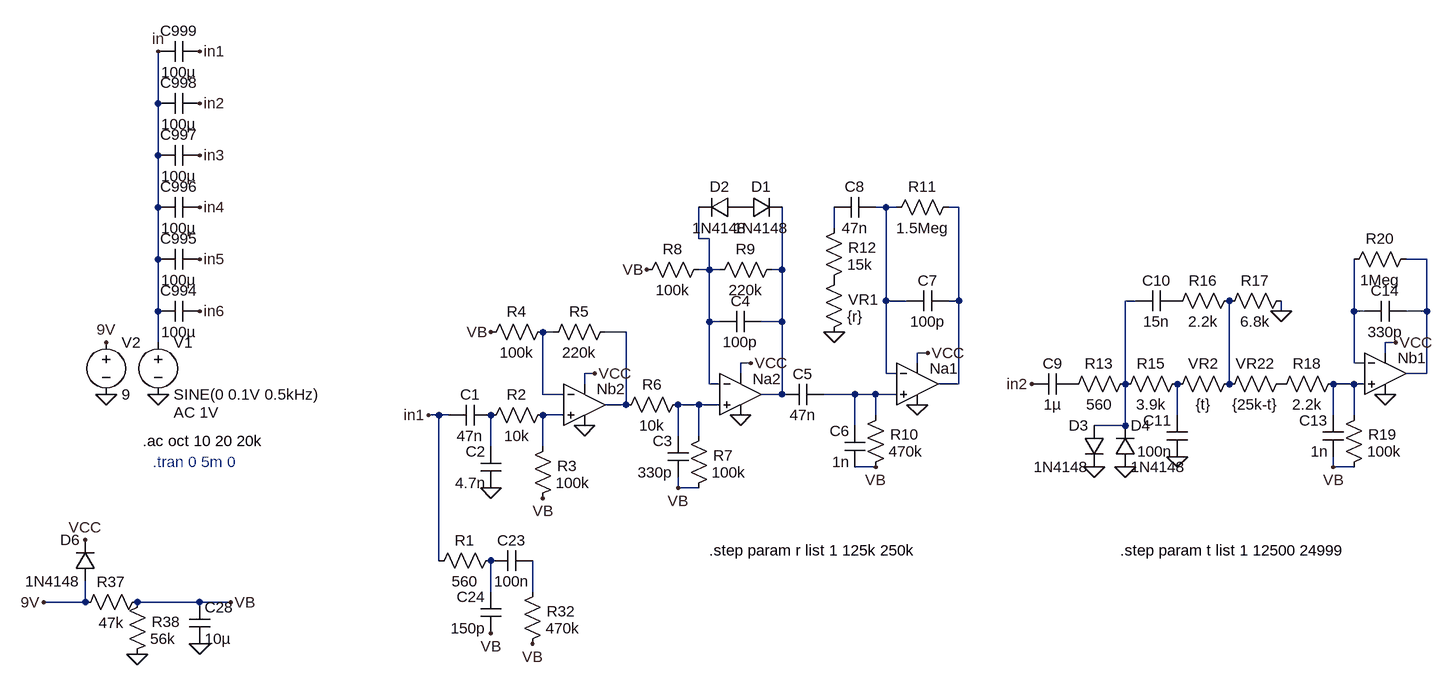
[diagram p0: schematic POS_DT-1.asc]
POS_DT-1.asc, the LTspice schematic file:
Version 4.1
SHEET 1 3408 3732
WIRE -1568 704 -1568 624
WIRE -1568 784 -1568 704
WIRE -1568 864 -1568 784
WIRE -448 864 -464 864
WIRE -432 864 -448 864
WIRE -336 864 -352 864
WIRE -528 896 -528 864
WIRE -736 912 -736 864
WIRE -720 912 -736 912
WIRE -1568 944 -1568 864
WIRE 384 944 352 944
WIRE -720 960 -720 912
WIRE -720 960 -736 960
WIRE -704 960 -720 960
WIRE -608 960 -608 864
WIRE -608 960 -624 960
WIRE -448 1008 -448 864
WIRE -416 1008 -448 1008
WIRE -336 1008 -336 864
WIRE -336 1008 -352 1008
WIRE -64 1008 -80 1008
WIRE -1568 1024 -1568 944
WIRE 160 1024 160 1008
WIRE 272 1024 272 944
WIRE 288 1024 272 1024
WIRE 384 1024 384 944
WIRE 384 1024 352 1024
WIRE -720 1040 -720 960
WIRE -704 1040 -720 1040
WIRE -608 1040 -608 960
WIRE -608 1040 -640 1040
WIRE -960 1056 -976 1056
WIRE -848 1056 -880 1056
WIRE -1568 1072 -1568 1024
WIRE 336 1072 320 1072
WIRE -384 1088 -400 1088
WIRE 320 1088 320 1072
WIRE -656 1104 -672 1104
WIRE -400 1104 -400 1088
WIRE 272 1104 272 1024
WIRE 288 1104 272 1104
WIRE -896 1120 -912 1120
WIRE -672 1120 -672 1104
WIRE -448 1120 -448 1008
WIRE -432 1120 -448 1120
WIRE 384 1120 384 1024
WIRE 384 1120 352 1120
WIRE -912 1136 -912 1120
WIRE -720 1136 -720 1040
WIRE -704 1136 -720 1136
WIRE -336 1136 -336 1008
WIRE -336 1136 -368 1136
WIRE -80 1136 -80 1008
WIRE 80 1136 80 1008
WIRE 272 1136 240 1136
WIRE 288 1136 272 1136
WIRE -976 1152 -976 1056
WIRE -944 1152 -976 1152
WIRE -608 1152 -608 1040
WIRE -608 1152 -640 1152
WIRE -496 1152 -544 1152
WIRE -464 1152 -496 1152
WIRE -432 1152 -464 1152
WIRE -848 1168 -848 1056
WIRE -848 1168 -880 1168
WIRE -736 1168 -768 1168
WIRE -704 1168 -736 1168
WIRE -1136 1184 -1152 1184
WIRE -1120 1184 -1136 1184
WIRE -944 1184 -976 1184
WIRE -464 1184 -464 1152
WIRE 0 1184 0 1136
WIRE 240 1184 240 1136
WIRE 272 1184 272 1136
WIRE -496 1200 -496 1152
WIRE -80 1200 -80 1136
WIRE -80 1200 -128 1200
WIRE -768 1216 -768 1168
WIRE -736 1216 -736 1168
WIRE -1056 1232 -1056 1184
WIRE -976 1232 -976 1184
WIRE -464 1264 -496 1264
WIRE 240 1264 240 1248
WIRE 272 1264 240 1264
WIRE -768 1296 -768 1280
WIRE -736 1296 -768 1296
WIRE -1136 1408 -1136 1184
WIRE -1056 1456 -1056 1408
WIRE -992 1456 -992 1408
WIRE -1680 1472 -1680 1440
WIRE -1680 1472 -1744 1472
WIRE -1504 1472 -1600 1472
WIRE -1456 1472 -1504 1472
FLAG -1568 1152 0
FLAG -1568 624 in
FLAG -1648 1152 0
FLAG -1504 624 in1
FLAG -1504 704 in2
FLAG -1504 784 in3
FLAG -1504 864 in4
FLAG -1504 944 in5
FLAG -1504 1024 in6
FLAG -1152 1184 in1
FLAG -912 1200 0
FLAG -1648 1072 9V
FLAG -1600 1552 0
FLAG -1504 1536 0
FLAG -1456 1472 VB
FLAG -1056 1056 VB
FLAG -1680 1376 VCC
FLAG -896 1120 VCC
FLAG -1744 1472 9V
FLAG -976 1312 VB
FLAG -1056 1296 0
FLAG -768 1296 VB
FLAG -672 1184 0
FLAG -656 1104 VCC
FLAG -816 960 VB
FLAG -464 1264 VB
FLAG -400 1168 0
FLAG -384 1088 VCC
FLAG -528 1056 0
FLAG -128 1264 0
FLAG -80 1264 0
FLAG 0 1248 0
FLAG 160 1024 0
FLAG 320 1152 0
FLAG 336 1072 VCC
FLAG 240 1264 VB
FLAG -224 1136 in2
FLAG -992 1536 VB
FLAG -1056 1520 VB
SYMBOL voltage -1568 1056 R0
WINDOW 123 24 124 Left 2
WINDOW 39 0 0 Left 2
SYMATTR Value2 AC 1V
SYMATTR InstName V1
SYMATTR Value SINE(0 0.1V 0.5kHz)
SYMBOL voltage -1648 1056 R0
WINDOW 123 0 0 Left 0
WINDOW 39 0 0 Left 0
SYMATTR InstName V2
SYMATTR Value 9
SYMBOL cap -1504 688 R90
WINDOW 0 0 32 VBottom 2
WINDOW 3 32 32 VTop 2
SYMATTR InstName C998
SYMATTR Value 100µ
SYMBOL cap -1504 768 R90
WINDOW 0 0 32 VBottom 2
WINDOW 3 32 32 VTop 2
SYMATTR InstName C997
SYMATTR Value 100µ
SYMBOL cap -1504 848 R90
WINDOW 0 0 32 VBottom 2
WINDOW 3 32 32 VTop 2
SYMATTR InstName C996
SYMATTR Value 100µ
SYMBOL cap -1504 608 R90
WINDOW 0 0 32 VBottom 2
WINDOW 3 32 32 VTop 2
SYMATTR InstName C999
SYMATTR Value 100µ
SYMBOL cap -1504 928 R90
WINDOW 0 0 32 VBottom 2
WINDOW 3 32 32 VTop 2
SYMATTR InstName C995
SYMATTR Value 100µ
SYMBOL cap -1504 1008 R90
WINDOW 0 0 32 VBottom 2
WINDOW 3 32 32 VTop 2
SYMATTR InstName C994
SYMATTR Value 100µ
SYMBOL cap -1056 1168 R90
WINDOW 0 0 32 VBottom 2
WINDOW 3 32 32 VTop 2
SYMATTR InstName C1
SYMATTR Value 47n
SYMBOL res -992 1328 M180
WINDOW 0 38 66 Left 2
WINDOW 3 36 40 Left 2
SYMATTR InstName R3
SYMATTR Value 100k
SYMBOL res -960 1168 R90
WINDOW 0 0 56 VBottom 2
WINDOW 3 32 56 VTop 2
SYMATTR InstName R2
SYMATTR Value 10k
SYMBOL Opamps\\UniversalOpamp2 -912 1168 R0
WINDOW 0 19 -24 Left 2
SYMATTR InstName Nb2
SYMBOL res -1584 1456 R90
WINDOW 0 0 56 VBottom 2
WINDOW 3 32 56 VTop 2
SYMATTR InstName R37
SYMATTR Value 47k
SYMBOL res -1616 1568 M180
WINDOW 0 38 66 Left 2
WINDOW 3 36 40 Left 2
SYMATTR InstName R38
SYMATTR Value 56k
SYMBOL cap -1520 1536 M180
WINDOW 0 24 56 Left 2
WINDOW 3 24 8 Left 2
SYMATTR InstName C28
SYMATTR Value 10µ
SYMBOL cap -1040 1296 R180
WINDOW 0 24 56 Left 2
WINDOW 3 24 8 Left 2
SYMATTR InstName C2
SYMATTR Value 4.7n
SYMBOL diode -1664 1440 R180
WINDOW 0 24 64 Left 2
WINDOW 3 24 0 Left 2
SYMATTR InstName D6
SYMATTR Value 1N4148
SYMBOL res -960 1040 R90
WINDOW 0 0 56 VBottom 2
WINDOW 3 32 56 VTop 2
SYMATTR InstName R4
SYMATTR Value 100k
SYMBOL res -864 1040 R90
WINDOW 0 0 56 VBottom 2
WINDOW 3 32 56 VTop 2
SYMATTR InstName R5
SYMATTR Value 220k
SYMBOL res -752 1152 R90
WINDOW 0 0 56 VBottom 2
WINDOW 3 32 56 VTop 2
SYMATTR InstName R6
SYMATTR Value 10k
SYMBOL cap -752 1280 R180
WINDOW 0 24 56 Left 2
WINDOW 3 24 8 Left 2
SYMATTR InstName C3
SYMATTR Value 330p
SYMBOL res -752 1312 M180
WINDOW 0 38 66 Left 2
WINDOW 3 36 40 Left 2
SYMATTR InstName R7
SYMATTR Value 100k
SYMBOL Opamps\\UniversalOpamp2 -672 1152 R0
WINDOW 0 19 -24 Left 2
SYMATTR InstName Na2
SYMBOL res -608 944 R90
WINDOW 0 0 56 VBottom 2
WINDOW 3 32 56 VTop 2
SYMATTR InstName R9
SYMATTR Value 220k
SYMBOL res -720 944 R90
WINDOW 0 0 56 VBottom 2
WINDOW 3 32 56 VTop 2
SYMATTR InstName R8
SYMATTR Value 100k
SYMBOL diode -672 880 R270
WINDOW 0 32 32 VTop 2
WINDOW 3 0 32 VBottom 2
SYMATTR InstName D1
SYMATTR Value 1N4148
SYMBOL diode -672 848 R90
WINDOW 0 0 32 VBottom 2
WINDOW 3 32 32 VTop 2
SYMATTR InstName D2
SYMATTR Value 1N4148
SYMBOL cap -704 1056 R270
WINDOW 0 32 32 VTop 2
WINDOW 3 0 32 VBottom 2
SYMATTR InstName C4
SYMATTR Value 100p
SYMBOL cap -608 1168 R270
WINDOW 0 32 32 VTop 2
WINDOW 3 0 32 VBottom 2
SYMATTR InstName C5
SYMATTR Value 47n
SYMBOL cap -480 1264 R180
WINDOW 0 24 56 Left 2
WINDOW 3 24 8 Left 2
SYMATTR InstName C6
SYMATTR Value 1n
SYMBOL res -480 1280 M180
WINDOW 0 38 66 Left 2
WINDOW 3 36 40 Left 2
SYMATTR InstName R10
SYMATTR Value 470k
SYMBOL Opamps\\UniversalOpamp2 -400 1136 R0
WINDOW 0 19 -24 Left 2
SYMATTR InstName Na1
SYMBOL cap -416 1024 R270
WINDOW 0 32 32 VTop 2
WINDOW 3 0 32 VBottom 2
SYMATTR InstName C7
SYMATTR Value 100p
SYMBOL res -336 848 R90
WINDOW 0 0 56 VBottom 2
WINDOW 3 32 56 VTop 2
SYMATTR InstName R11
SYMATTR Value 1.5Meg
SYMBOL res -544 992 M180
WINDOW 0 38 66 Left 2
WINDOW 3 36 40 Left 2
SYMATTR InstName R12
SYMATTR Value 15k
SYMBOL cap -528 880 R270
WINDOW 0 32 32 VTop 2
WINDOW 3 0 32 VBottom 2
SYMATTR InstName C8
SYMATTR Value 47n
SYMBOL res -544 1072 M180
WINDOW 0 38 66 Left 2
WINDOW 3 36 40 Left 2
SYMATTR InstName VR1
SYMATTR Value {r}
SYMBOL cap -224 1152 R270
WINDOW 0 32 32 VTop 2
WINDOW 3 0 32 VBottom 2
SYMATTR InstName C9
SYMATTR Value 1µ
SYMBOL res -64 1120 R90
WINDOW 0 0 56 VBottom 2
WINDOW 3 32 56 VTop 2
SYMATTR InstName R13
SYMATTR Value 560
SYMBOL diode -96 1264 M180
WINDOW 0 24 64 Left 2
WINDOW 3 24 0 Left 2
SYMATTR InstName D4
SYMATTR Value 1N4148
SYMBOL diode -112 1200 M0
SYMATTR InstName D3
SYMATTR Value 1N4148
SYMBOL res 16 1120 R90
WINDOW 0 0 56 VBottom 2
WINDOW 3 32 56 VTop 2
SYMATTR InstName R15
SYMATTR Value 3.9k
SYMBOL cap 16 1248 R180
WINDOW 0 24 56 Left 2
WINDOW 3 24 8 Left 2
SYMATTR InstName C11
SYMATTR Value 100n
SYMBOL res 96 1120 R90
WINDOW 0 0 56 VBottom 2
WINDOW 3 32 56 VTop 2
SYMATTR InstName VR2
SYMATTR Value {t}
SYMBOL res 176 1120 R90
WINDOW 0 0 56 VBottom 2
WINDOW 3 32 56 VTop 2
SYMATTR InstName VR22
SYMATTR Value {25k-t}
SYMBOL res 176 992 R90
WINDOW 0 0 56 VBottom 2
WINDOW 3 32 56 VTop 2
SYMATTR InstName R17
SYMATTR Value 6.8k
SYMBOL res 96 992 R90
WINDOW 0 0 56 VBottom 2
WINDOW 3 32 56 VTop 2
SYMATTR InstName R16
SYMATTR Value 2.2k
SYMBOL cap -64 1024 R270
WINDOW 0 32 32 VTop 2
WINDOW 3 0 32 VBottom 2
SYMATTR InstName C10
SYMATTR Value 15n
SYMBOL Opamps\\UniversalOpamp2 320 1120 R0
WINDOW 0 19 -24 Left 2
SYMATTR InstName Nb1
SYMBOL res 256 1120 R90
WINDOW 0 0 56 VBottom 2
WINDOW 3 32 56 VTop 2
SYMATTR InstName R18
SYMATTR Value 2.2k
SYMBOL cap 256 1248 R180
WINDOW 0 24 56 Left 2
WINDOW 3 24 8 Left 2
SYMATTR InstName C13
SYMATTR Value 1n
SYMBOL res 256 1280 M180
WINDOW 0 38 66 Left 2
WINDOW 3 36 40 Left 2
SYMATTR InstName R19
SYMATTR Value 100k
SYMBOL cap 288 1040 R270
WINDOW 0 32 32 VTop 2
WINDOW 3 0 32 VBottom 2
SYMATTR InstName C14
SYMATTR Value 330p
SYMBOL res 368 928 R90
WINDOW 0 0 56 VBottom 2
WINDOW 3 32 56 VTop 2
SYMATTR InstName R20
SYMATTR Value 1Meg
SYMBOL res -1040 1392 R90
WINDOW 0 0 56 VBottom 2
WINDOW 3 32 56 VTop 2
SYMATTR InstName R1
SYMATTR Value 560
SYMBOL cap -992 1392 R90
WINDOW 0 0 32 VBottom 2
WINDOW 3 32 32 VTop 2
SYMATTR InstName C23
SYMATTR Value 100n
SYMBOL cap -1040 1520 R180
WINDOW 0 24 56 Left 2
WINDOW 3 24 8 Left 2
SYMATTR InstName C24
SYMATTR Value 150p
SYMBOL res -1008 1552 M180
WINDOW 0 38 66 Left 2
WINDOW 3 36 40 Left 2
SYMATTR InstName R32
SYMATTR Value 470k
TEXT -1592 1224 Left 2 !.ac oct 10 20 20k
TEXT -1576 1256 Left 2 ;.tran 0 5m 0
TEXT -720 1392 Left 2 !.step param r list 1 125k 250k
TEXT -88 1392 Left 2 !.step param t list 1 12500 24999

The netlist it stands for:
* POS_DT-1.asc
V1 in 0 SINE(0 0.1V 0.5kHz) AC 1V
V2 9V 0 9
C998 in2 in 100µ
C997 in3 in 100µ
C996 in4 in 100µ
C999 in1 in 100µ
C995 in5 in 100µ
C994 in6 in 100µ
C1 N017 in1 47n
R3 VB N015 100k
R2 N015 N017 10k
X§Nb2 N015 N009 VCC 0 N010 level.2 Avol=1Meg GBW=10Meg Slew=10Meg ilimit=25m rail=0 Vos=0 phimargin=45 en=0 enk=0 in=0 ink=0 Rin=500Meg  ; pins IN+ IN- V+ V- OUT
R37 VB 9V 47k
R38 0 VB 56k
C28 0 VB 10µ
C2 0 N017 4.7n
D6 9V VCC 1N4148
R4 N009 VB 100k
R5 N010 N009 220k
R6 N014 N010 10k
C3 VB N014 330p
R7 VB N014 100k
X§Na2 N014 N004 VCC 0 N006 level.2 Avol=1Meg GBW=10Meg Slew=10Meg ilimit=25m rail=0 Vos=0 phimargin=45 en=0 enk=0 in=0 ink=0 Rin=500Meg  ; pins IN+ IN- V+ V- OUT
R9 N006 N004 220k
R8 N004 VB 100k
D1 P001 N006 1N4148
D2 P001 N004 1N4148
C4 N004 N006 100p
C5 N006 N013 47n
C6 VB N013 1n
R10 VB N013 470k
X§Na1 N013 N001 VCC 0 N002 level.2 Avol=1Meg GBW=10Meg Slew=10Meg ilimit=25m rail=0 Vos=0 phimargin=45 en=0 enk=0 in=0 ink=0 Rin=500Meg  ; pins IN+ IN- V+ V- OUT
C7 N001 N002 100p
R11 N002 N001 1.5Meg
R12 P002 N003 15k
C8 N003 N001 47n
R§VR1 0 P002 {r}
C9 in2 P003 1µ
R13 N007 P003 560
D4 0 N007 1N4148
D3 N007 0 1N4148
R15 N016 N007 3.9k
C11 0 N016 100n
R§VR2 N011 N016 {t}
R§VR22 P004 N011 {25k-t}
R17 0 N011 6.8k
R16 N011 P005 2.2k
C10 N007 P005 15n
X§Nb1 N012 N008 VCC 0 N005 level.2 Avol=1Meg GBW=10Meg Slew=10Meg ilimit=25m rail=0 Vos=0 phimargin=45 en=0 enk=0 in=0 ink=0 Rin=500Meg  ; pins IN+ IN- V+ V- OUT
R18 N012 P004 2.2k
C13 VB N012 1n
R19 VB N012 100k
C14 N008 N005 330p
R20 N005 N008 1Meg
R1 N018 in1 560
C23 N019 N018 100n
C24 VB N018 150p
R32 VB N019 470k
.model D D
.lib standard.dio
.ac oct 10 20 20k
* .tran 0 5m 0
.step param r list 1 125k 250k
.step param t list 1 12500 24999
.lib UniversalOpamps2.sub
.backanno
.end